# EAGLE design pressure_foot (EAGLE 6.2)
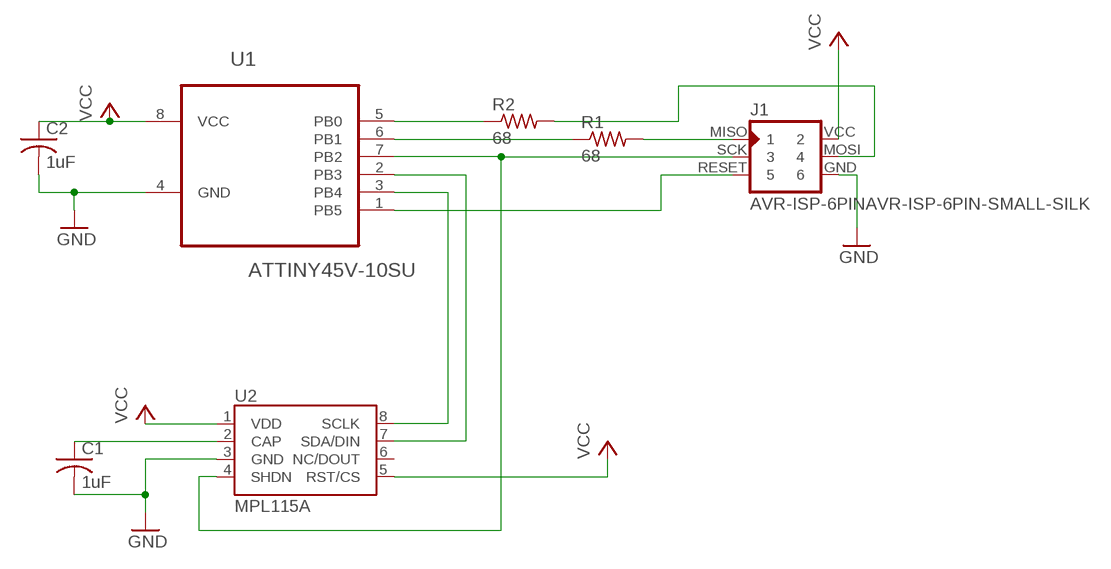
[diagram p0: schematic, sheet 1]

## Parts
C1  1uF  C-USC0603  [C0603]
C2  1uF  C-USC0603  [C0603]
J1  AVR-ISP-6PINAVR-ISP-6PIN-SMALL-SILK  [AVR-ISP-6PIN-SMAILL-SILK]
R1  68  R-US_R0603  [R0603]
R2  68  R-US_R0603  [R0603]
U1  ATTINY45V-10SU  [SOIC127P798X216-8N]
U2  MPL115A  [LGA8]

## Nets
GND: C1.2 C2.2 J1.GND U1.4(GND) U2.3(GND)
N$1: J1.RESET U1.1(PB5)
N$2: J1.MISO R1.2
N$3: R2.1 U1.5(PB0)
N$4: R1.1 U1.6(PB1)
N$5: J1.MOSI R2.2
N$6: C1.1 U2.2(CAP)
N$8: U1.3(PB4) U2.8(SCLK)
N$9: U1.2(PB3) U2.7(SDA/DIN)
N$10: J1.SCK U1.7(PB2) U2.4(SHDN)
VCC: C2.1 J1.VCC U1.8(VCC) U2.1(VDD) U2.5(RST/CS)
Unconnected: U2.6(NC/DOUT)

## Library data of the parts
C1 C2 = rcl:C-US: CAPACITOR, American symbol
J1 = avr-isp:AVR-ISP-6PIN: AVR ISP 6pin 3x2 pin header
R1 R2 = rcl:R-US_: RESISTOR, American symbol
U1 = Atmel_By_element14_Batch_1-00:ATTINY45V-10SU: 8-bit Microcontroller with In-System Programmable Flash; MPN: ATTINY45V-10SU; OC_FARNELL: 1288355; OC_NEWARK: 23M5075; PACKAGE: SOIC-8; SUPPLIER: Atmel
U2 = SparkFun-Sensors:MPL115A: MPL115A1 (SPI) and MPL115A2 (I2C) Miniature Digital Barometer 5.0x3.0x1.2mm LGA Package

## Board
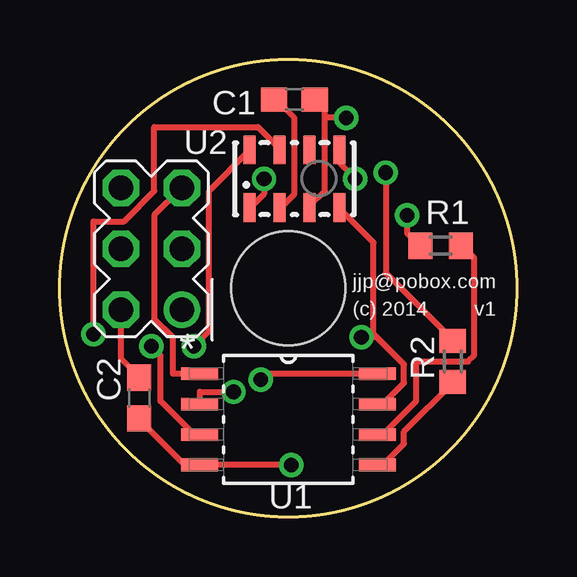
[diagram p1: board, top side]
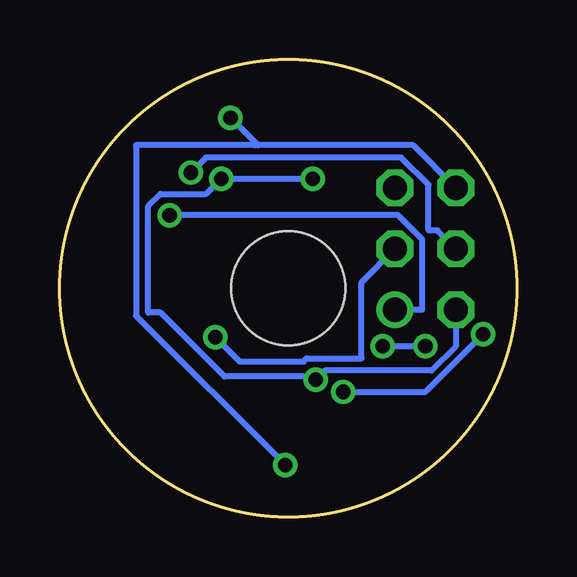
[diagram p2: board, bottom side, seen from below]

Size 19.05 x 19.05 mm. Coordinates in mm from the lower left corner, seen from the top.
Outline: circle at 9.53,9.53 radius 9.53
Copper layers (1*16): Top 0.035mm / dielectric 1.5mm / Bottom 0.035mm
Design rules: minimum track width 10mil, minimum drill 24mil, track to track 7mil, track to pad 7mil, pad to pad 7mil, via to via 7mil, smd to smd 7mil, copper to edge 20mil, drill to drill 8mil, minimum pad ring 10mil, minimum via ring 8mil, stop-mask expansion 4mil, vias tented up to drill 0mil, thermal gap 10mil
Holes 4.76 mm at 9.53,9.53

### Footprints (pad centres in the part's own frame; a part is rotated, then mirrored left to right if it is on the bottom)
C0603 = smd 1.1 x 1: 1 -0.85,0; 2 0.85,0
AVR-ISP-6PIN-SMAILL-SILK = drill 1.016 octagon: GND 1.27,-2.54; MOSI 1.27,0; RESET -1.27,-2.54; SCK -1.27,0; VCC 1.27,2.54 | drill 1.016: MISO -1.27,2.54
R0603 = smd 1 x 1.1: 1 -0.85,0; 2 0.85,0
SOIC127P798X216-8N = smd 1.549 x 0.533: 1 -3.708,1.905; 2 -3.708,0.635; 3 -3.708,-0.635; 4 -3.708,-1.905; 5 3.708,-1.905; 6 3.708,-0.635; 7 3.708,0.635; 8 3.708,1.905
LGA8 = smd 1.2 x 0.5: 1 -1.2,1.875; 2 -1.2,0.625; 3 -1.2,-0.625; 4 -1.2,-1.875; 5 1.2,-1.875; 6 1.2,-0.625; 7 1.2,0.625; 8 1.2,1.875

### Placement (x,y rotation side)
C1  9.78,17.4 0 top
C2  3.3,4.95 270 top
J1  3.81,11.18 180 top
R1  15.88,11.3 180 top
R2  16.38,6.48 90 top
U1  9.53,4.06 0 top
U2  9.78,14.1 90 top

### Tracks (layer width: path | path; a pad name or v marks a point on that pad's centre or on a via)
GND  (via drill 0.61)
  Top 0.254: C2.2 3.3,4.06 5.21,2.16 U1.4 v9.65,2.16 | 11.05,16.64 11.05,13.59 10.41,12.95 U2.3 | 11.05,16.64 11.05,17.02 10.67,17.4 C1.2 | v11.94,16.64 11.05,16.64
  Bottom 0.254: 10.86,15.56 10.79,15.49 4.32,15.49 J1.GND | 10.86,15.56 v11.94,16.64 | v9.65,2.16 15.88,8.38 15.88,15.49 10.92,15.49 10.86,15.56
N$1
  Top 0.254: U1.1 4.7,5.97 4.7,7.49 3.94,8.25 3.94,12.57 J1.RESET
N$2  (via drill 0.61)
  Top 0.254: v14.48,12.57 14.48,11.81 14.99,11.3 R1.2
  Bottom 0.254: v14.48,12.57 4.95,12.57 3.94,11.56 3.94,8.64 J1.MISO
N$3
  Top 0.254: U1.5 13.46,2.16 14.35,3.05 14.35,3.56 16.38,5.59 R2.1
N$4
  Top 0.254: U1.6 13.46,3.43 14.86,4.83 14.86,6.48 17.02,6.48 17.27,6.73 17.27,10.79 16.76,11.3 R1.1
N$5  (via drill 0.61)
  Top 0.254: v13.59,14.35 13.59,10.16 16.38,7.37 R2.2
  Bottom 0.254: v13.59,14.35 12.95,14.99 4.83,14.99 3.68,13.84 3.68,11.94 3.3,11.94 J1.MOSI
N$6
  Top 0.254: C1.1 9.02,17.4 9.78,16.64 9.78,13.46 9.27,12.95 U2.2
N$8  (via drill 0.61)
  Top 0.254: v5.59,7.11 6.22,7.75 6.22,13.59 7.87,15.24 U2.8 | v3.81,7.11 4.19,6.73 4.19,4.83 5.59,3.43 U1.3
  Bottom 0.254: v3.81,7.11 v5.59,7.11
N$9  (via drill 0.61)
  Top 0.254: v1.4,7.62 1.4,12.32 2.67,12.32 3.94,13.59 3.94,16.26 8.25,16.26 9.14,15.37 U2.7 | v7.24,5.21 5.84,5.21 5.84,4.7 U1.2
  Bottom 0.254: v1.4,7.62 3.81,5.21 v7.24,5.21
N$10  (via drill 0.61)
  Top 0.254: 13.14,7.56 14.35,6.35 14.35,5.59 13.46,4.7 U1.7 | 13.14,7.56 13.08,7.62 13.08,11.43 11.68,12.83 U2.4 | v12.57,7.49 13.08,7.49 13.14,7.56
  Bottom 0.254: J1.SCK 6.48,9.78 6.48,6.6 8.76,6.6 8.89,6.48 11.56,6.48 v12.57,7.49
VCC  (via drill 0.61)
  Top 0.254: v8.51,14.1 8.51,13.46 8,12.95 U2.1 | v12.32,14.1 11.68,14.73 11.68,15.24 U2.5 | J1.VCC 2.54,6.6 3.3,5.84 C2.1 | U1.8 8.38,5.97 v8.38,5.71
  Bottom 0.254: v8.51,14.1 v12.32,14.1 12.95,13.46 14.86,13.46 15.37,12.95 15.37,8.51 14.86,8.51 12.19,5.84 8.38,5.84 v8.38,5.71 8,6.1 3.56,6.1 2.54,7.11 J1.VCC

### Text on the board
tPlace: jjp@pobox.com | (c) 2014 | v1